# EAGLE design Daughter_ESCON_24-2 (EAGLE 9.3.1)
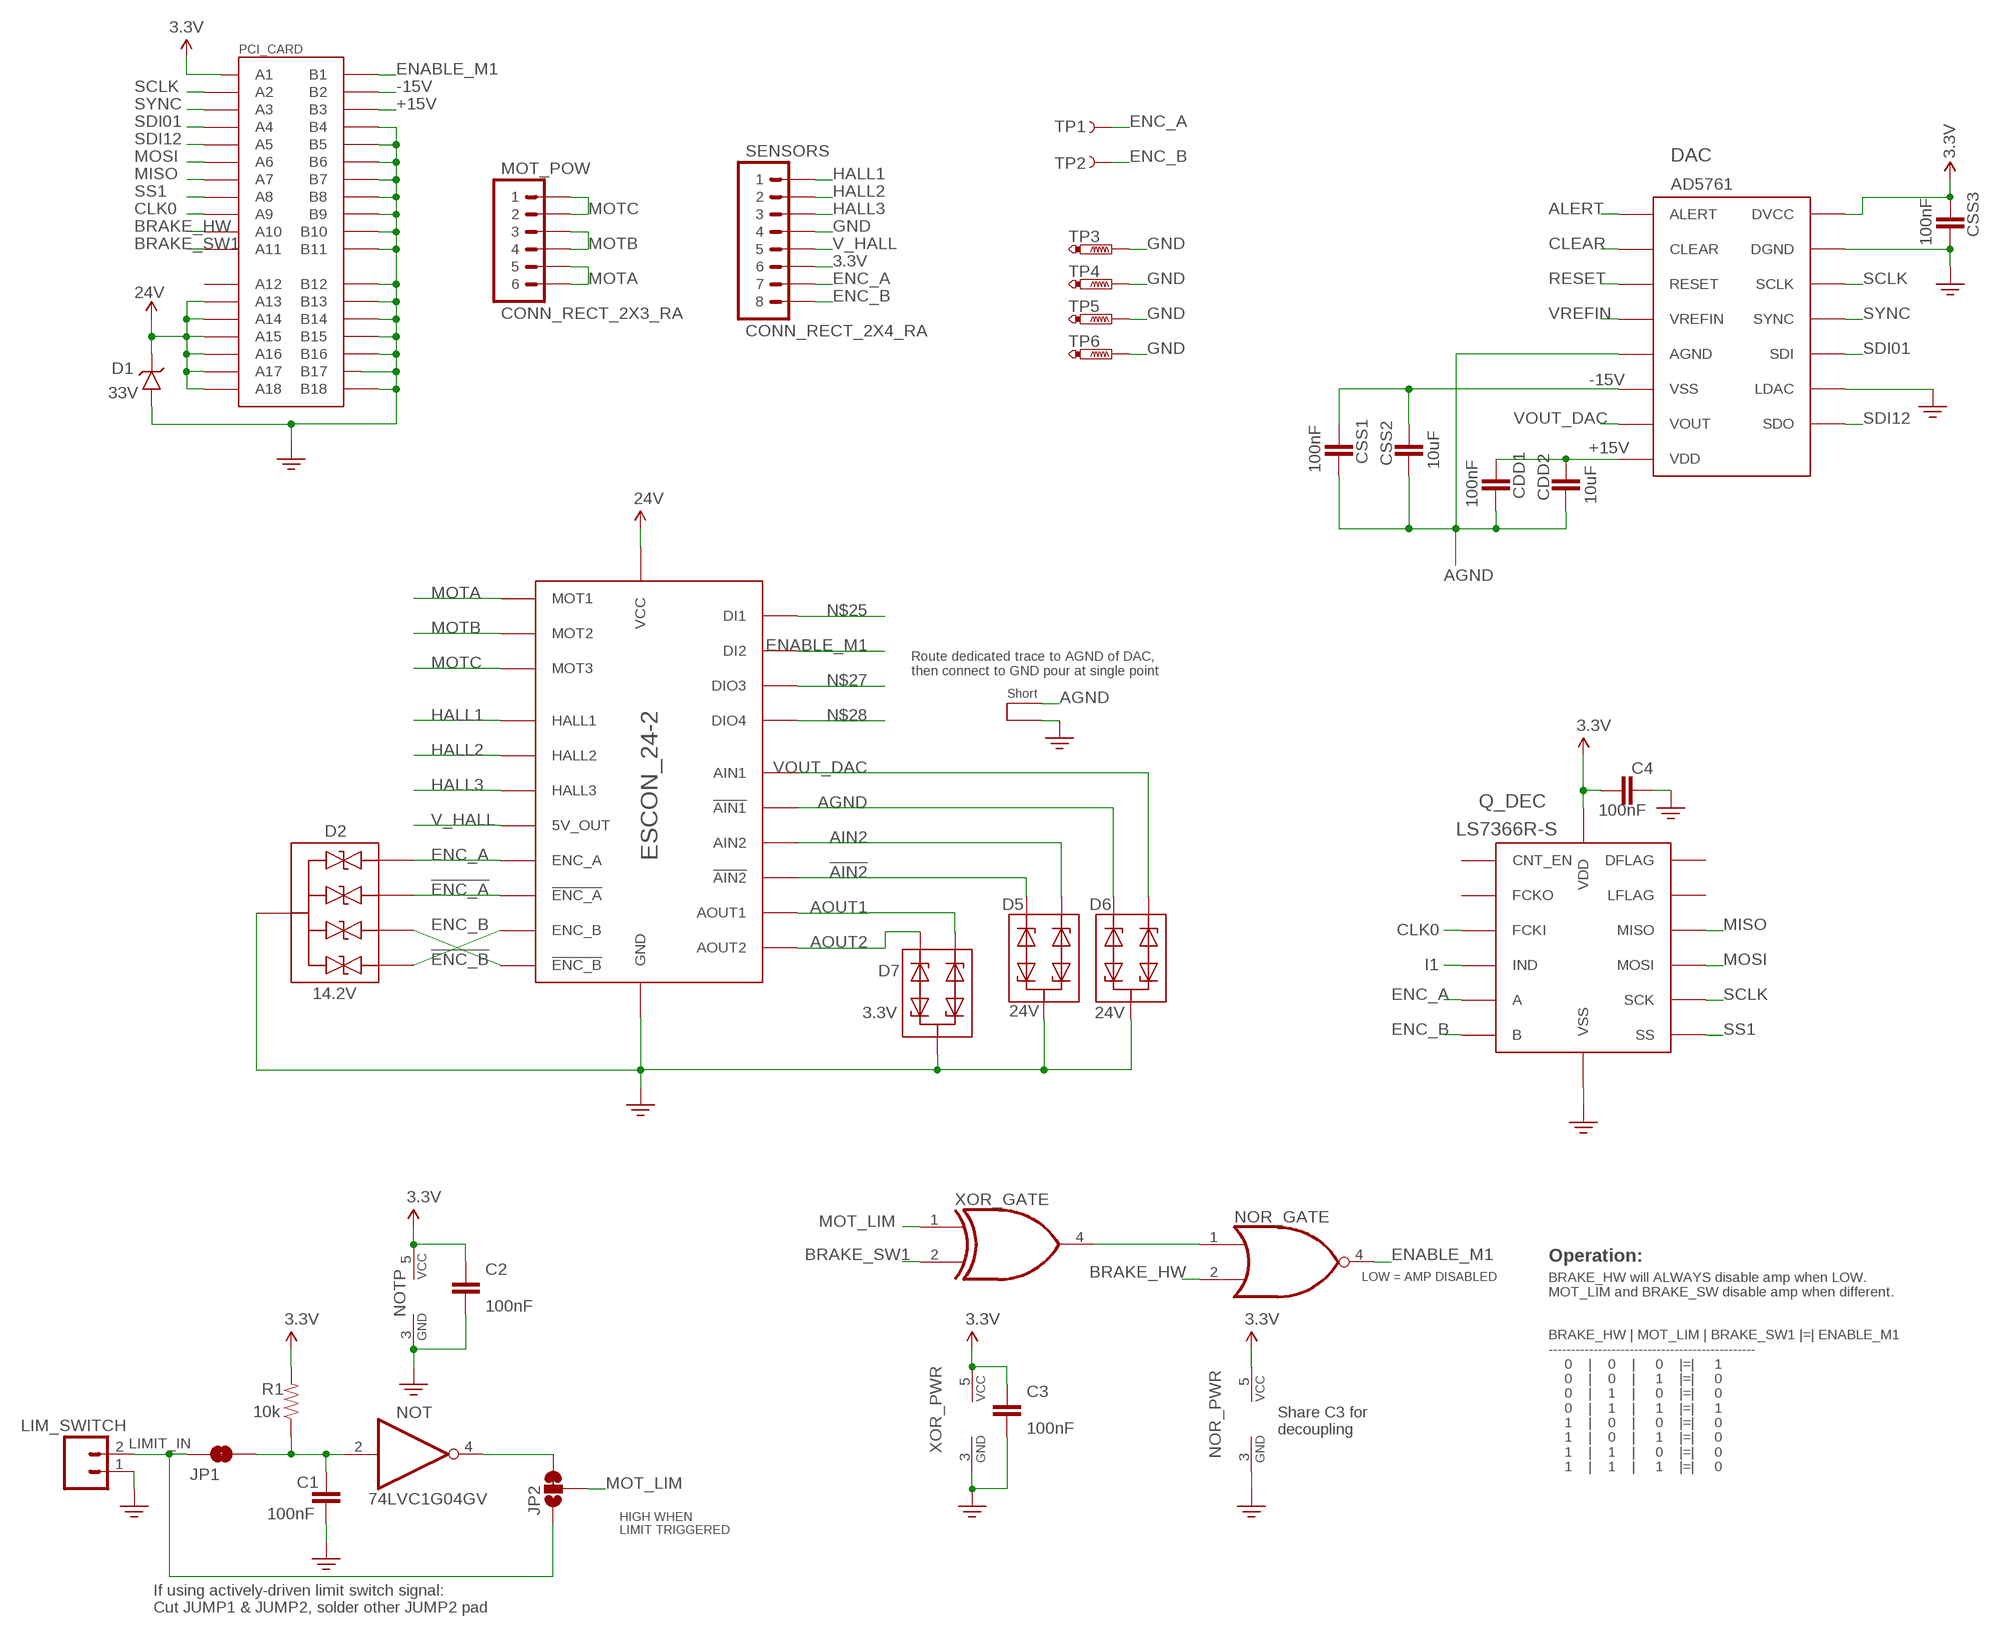
[diagram p0: schematic, sheet 1]

## Parts
C1  100nF  CAP0603-CAP  [0603-CAP]
C2  100nF  CAP0603-CAP  [0603-CAP]
C3  100nF  CAP0603-CAP  [0603-CAP]
C4  100nF  CAP0603-CAP  [0603-CAP]
CDD1  100nF  CAP0603-CAP  [0603-CAP]
CDD2  10uF  CAP0805  [C0805K]
CSS1  100nF  CAP0603-CAP  [0603-CAP]
CSS2  10uF  CAP0805  [C0805K]
CSS3  100nF  CAP0603-CAP  [0603-CAP]
D1  33V  DIODE_TVS_UNIDIR_1  [DO214AA]
D2  14.2V  DIODE_TVS_BIDIR_4  [SOTFL50P160X60-6]
D5  24V  DIODE_TVS_BIDIR_2  [SOT95P230X110-3]
D6  24V  DIODE_TVS_BIDIR_2  [SOT95P230X110-3]
D7  3.3V  DIODE_TVS_BIDIR_2  [SOT95P230X110-3]
DAC  AD5761  [TSSOP16]
ESCON_24-2  ESCON_MODULE24-2_BOTTOM_ENTRY  [ESCON_24-2_BOTTOM_ENTRY]
JP1  JUMPER-PAD-2-NC_BY_TRACE  [PAD-JUMPER-2-NC_BY_TRACE_YES_SILK]
JP2  JUMPER-PAD-3-2OF3_NC_BY_TRACE  [PAD-JUMPER-3-2OF3_NC_BY_TRACE_YES_SILK_FULL_BOX]
LIM_SWITCH  22-05-7028-02  [7395-02]
MOT_POW  CONN_RECT_2X3_RA  [2X3-RA]
NOR  NOR-SOT353  [SOT353]
NOT  74LVC1G04GV  74LVC1G04DBV  [SOT23-5]
PCI_CARD  PCIE-36-EDGE  [PCIE-36-EDGE]
Q_DEC  LS7366R-S  [SOIC-14]
R1  10k  RESISTOR-0603  [0603-RES]
SENSORS  CONN_RECT_2X4_RA  [2X4-RA]
TP1  TEST-POINT_5021  [TEST-POINT_5021]
TP2  TEST-POINT_5021  [TEST-POINT_5021]
TP3  PTR1TP20R  [TP20R]
TP4  PTR1TP20R  [TP20R]
TP5  PTR1TP20R  [TP20R]
TP6  PTR1TP20R  [TP20R]
U$1  SHORT  [SHORT]
XOR  XOR-SOT353  [SOT353]

## Nets
3.3V: C2.1 C3.1 C4.1 CSS3.1 DAC.15(DVCC) NOR.5(_PWR:VCC) NOT.5(VCC) PCI_CARD.A1 Q_DEC.14(VDD) R1.2 SENSORS.6 XOR.5(_PWR:VCC)
24V: D1.C ESCON_24-2.P$4(VCC) PCI_CARD.A13 PCI_CARD.A14 PCI_CARD.A15 PCI_CARD.A16 PCI_CARD.A17 PCI_CARD.A18
!AIN2: D5.1 ESCON_24-2.P$21(!AIN2)
!ENC_A: D2.3(IO2) ESCON_24-2.P$11(!ENC_A)
!ENC_B: D2.4(IO3) ESCON_24-2.P$13(!ENC_B)
+15V: CDD1.1 CDD2.1 DAC.8(VDD) PCI_CARD.B3
-15V: CSS1.1 CSS2.1 DAC.6(VSS) PCI_CARD.B2
AGND: CDD1.2 CDD2.2 CSS1.2 CSS2.2 D6.1 DAC.5(AGND) ESCON_24-2.P$23(!AIN1) U$1.P$1
AIN2: D5.2 ESCON_24-2.P$22(AIN2)
ALERT: DAC.1(ALERT)
AOUT1: D7.2 ESCON_24-2.P$20(AOUT1)
AOUT2: D7.1 ESCON_24-2.P$19(AOUT2)
BRAKE_HW: NOR.2(_GATE:B) PCI_CARD.A10
BRAKE_SW1: PCI_CARD.A11 XOR.2(_GATE:B)
CLEAR: DAC.2(CLEAR)
CLK0: PCI_CARD.A9 Q_DEC.2(FCKI)
ENABLE_M1: ESCON_24-2.P$16(DI2) NOR.4(_GATE:Y) PCI_CARD.B1
ENC_A: D2.1(IO1) ESCON_24-2.P$10(ENC_A) Q_DEC.12(A) SENSORS.7 TP1.P$1
ENC_B: D2.6(IO4) ESCON_24-2.P$12(ENC_B) Q_DEC.11(B) SENSORS.8 TP2.P$1
GND: C1.2 C2.2 C3.2 C4.2 CSS3.2 D1.A D2.2(GND) D2.5(GND) D5.3 D6.3 D7.3 DAC.11(LDAC) DAC.16(DGND) ESCON_24-2.P$5(GND) ESCON_24-2.P$18(GND) LIM_SWITCH.1 NOR.3(_PWR:GND) NOT.3(GND) PCI_CARD.B4 PCI_CARD.B5 PCI_CARD.B6 PCI_CARD.B7 PCI_CARD.B8 PCI_CARD.B9 PCI_CARD.B10 PCI_CARD.B11 PCI_CARD.B12 PCI_CARD.B13 PCI_CARD.B14 PCI_CARD.B15 PCI_CARD.B16 PCI_CARD.B17 PCI_CARD.B18 Q_DEC.3(VSS) SENSORS.4 TP3.TP TP4.TP TP5.TP TP6.TP U$1.P$2 XOR.3(_PWR:GND) ; supply symbol labelled GND2
HALL1: ESCON_24-2.P$7(HALL1) SENSORS.1
HALL2: ESCON_24-2.P$8(HALL2) SENSORS.2
HALL3: ESCON_24-2.P$9(HALL3) SENSORS.3
I1: Q_DEC.10(IND)
LIMIT_IN: JP1.1 JP2.1 LIM_SWITCH.2
MISO: PCI_CARD.A7 Q_DEC.6(MISO)
MOSI: PCI_CARD.A6 Q_DEC.7(MOSI)
MOT_LIM: JP2.2 XOR.1(_GATE:A)
MOTA: ESCON_24-2.P$1(MOT1) MOT_POW.5 MOT_POW.6
MOTB: ESCON_24-2.P$2(MOT2) MOT_POW.3 MOT_POW.4
MOTC: ESCON_24-2.P$3(MOT3) MOT_POW.1 MOT_POW.2
N$5: C1.1 JP1.2 NOT.2(I) R1.1
N$6: JP2.3 NOT.4(O)
N$14: NOR.1(_GATE:A) XOR.4(_GATE:Y)
N$25: ESCON_24-2.P$17(DI1)
N$27: ESCON_24-2.P$15(DIO3)
N$28: ESCON_24-2.P$14(DIO4)
RESET: DAC.3(RESET)
SCLK: DAC.14(SCLK) PCI_CARD.A2 Q_DEC.5(SCK)
SDI01: DAC.12(SDI) PCI_CARD.A4
SDI12: DAC.10(SDO) PCI_CARD.A5
SS1: PCI_CARD.A8 Q_DEC.4(SS)
SYNC: DAC.13(SYNC) PCI_CARD.A3
V_HALL: ESCON_24-2.P$6(5V_OUT) SENSORS.5
VOUT_DAC: D6.2 DAC.7(VOUT) ESCON_24-2.P$24(AIN1)
VREFIN: DAC.4(VREFIN)
Unconnected: PCI_CARD.A12 Q_DEC.1(FCKO) Q_DEC.8(LFLAG) Q_DEC.9(DFLAG) Q_DEC.13(CNT_EN)

## Notes on the sheet
- Route dedicated trace to AGND of DAC, 
  then connect to GND pour at single point
- Operation:
- LOW = AMP DISABLED
- BRAKE_HW will ALWAYS disable amp when LOW.
  MOT_LIM and BRAKE_SW disable amp when different.
- Share C3 for
  decoupling
- BRAKE_HW | MOT_LIM | BRAKE_SW1 |=| ENABLE_M1
  ----------------------------------------------
      0    |    0    |     0    |=|     1
      0    |    0    |     1    |=|     0
      0    |    1    |     0    |=|     0
      0    |    1    |     1    |=|     1
      1    |    0    |     0    |=|     0
      1    |    0    |     1    |=|     0
      1    |    1    |     0    |=|     0
      1    |    1    |     1    |=|     0
- HIGH WHEN
  LIMIT TRIGGERED
- If using actively-driven limit switch signal:
  Cut JUMP1 & JUMP2, solder other JUMP2 pad

## Library data of the parts
C1-C4 CDD1 CSS1 CSS3 = SparkFun-Capacitors:CAP: Capacitor Standard 0603 ceramic capacitor, and 0.1" leaded capacitor.
CDD2 CSS2 = Cannula_1_0:CAP0805
D1 = Cannula_1_0:DIODE_TVS_UNIDIR_1
D2 = Cannula_1_0:DIODE_TVS_BIDIR_4: TVS Diode Network Bidirectional, 4 channels ESDA, TRANSIL series <https://www.st.com/content/ccc/resource/technical/document/datasheet/12/9a/72/50/3e/c0/4e/7e/CD00091403.pdf/files/CD00091403.pdf/jcr:content/translations/en.CD00091403.pdf> by STMicroelectronics Trevor Bruns October 2018
D5-D7 = Cannula_1_0:DIODE_TVS_BIDIR_2: TVS Diode Network Bidirectional, 2 channels PESD1CAN <https://assets.nexperia.com/documents/data-sheet/PESD1CAN.pdf> by Nexperia Trevor Bruns October 2018
DAC = Cannula_1_0:AD5761: AD5761R Multiple Range, 16-bit, Bipolar/Unipolar Voltage Output DAC datasheet <http://www.analog.com/media/en/technical-documentation/data-sheets/AD5761R_5721R.pdf> Trevor Bruns- 2015
ESCON_24-2 = Cannula_1_0:ESCON_MODULE
JP1 = SparkFun-Passives:JUMPER-PAD-2-NC_BY_TRACE
JP2 = SparkFun-Passives:JUMPER-PAD-3-2OF3_NC_BY_TRACE
LIM_SWITCH = Cannula_1_0:22-?-02: CONNECTOR wire to board 2.54 mm (.1 inch) pitch header; OC_FARNELL: 9731601; OC_NEWARK: unknown
MOT_POW = Cannula_1_0:CONN_RECT_2X3
NOR = Cannula_1_0:NOR: Single 2-Input NOR Gate Digikey: 74AHC1G02SE-7DICT-ND Datasheet <http://www.diodes.com/datasheets/74AHC1G02.pdf> Trevor Bruns 6/1/2015
NOT = 74xx-little-us:74*1G04: INVERTER Gate
PCI_CARD = Cannula_1_0:PCIE-36-*: PCI-E 36-way connectors
Q_DEC = Cannula_1_0:LS7366R: LS7366R 32-Bit Quadrature Counter with SPI datasheet <http://www.lsicsi.com/pdfs/Data_Sheets/LS7366R.pdf> Trevor Bruns- 2015
R1 = Cannula_1_0:RESISTOR
SENSORS = Cannula_1_0:CONN_RECT_2X4
TP1 TP2 = Cannula_1_0:TEST-POINT: Bare copper test points for troubleshooting or ICT
TP3-TP6 = testpad:PTR1: TEST PIN
U$1 = Cannula_1_0:SHORT
XOR = Cannula_1_0:XOR

## Board
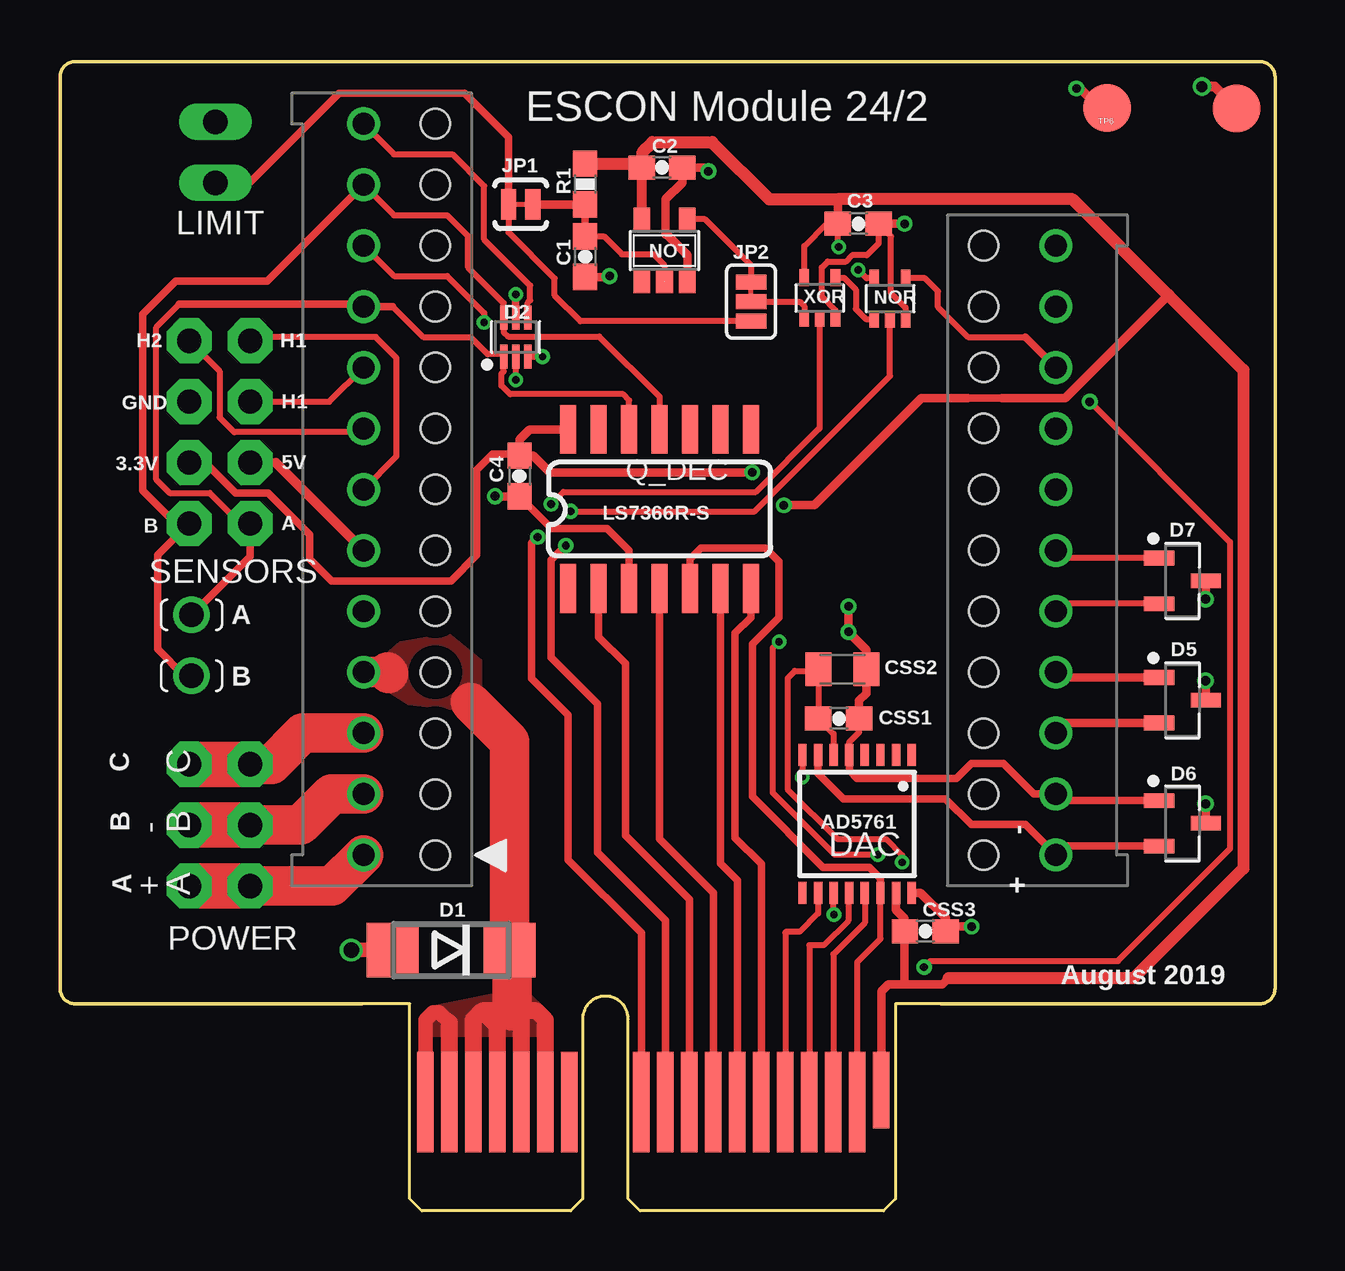
[diagram p1: board, top side]
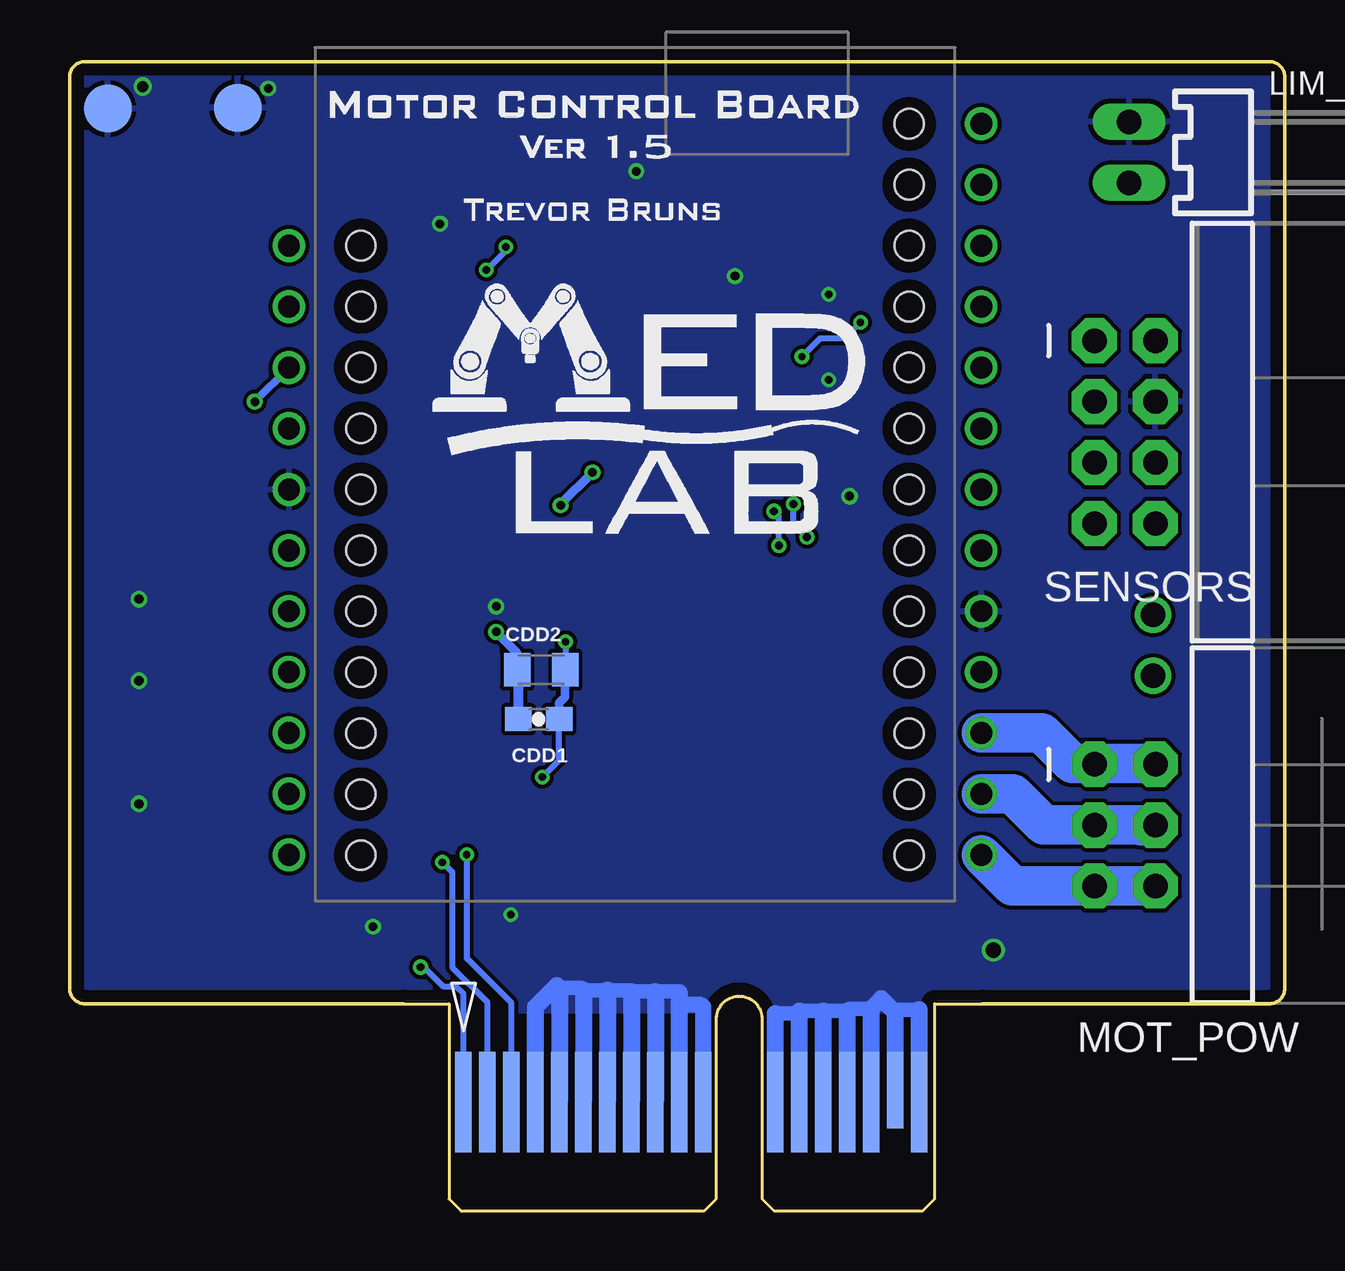
[diagram p2: board, bottom side, seen from below]

Size 50.65 x 47.9 mm. Coordinates in mm from the lower left corner, seen from the top.
Outline: 12.6,8.64 0.63,8.64 arc-90 0,9.27 0,47.27 arc-90 0.63,47.9 50.01,47.9 arc-90 50.65,47.27 50.65,9.27 arc-90 50.01,8.64 36.73,8.64
Copper layers (1*16): Top 0.035mm / dielectric 1.5mm / Bottom 0.035mm
Design rules "PCBWay_2018-01-18 *": minimum track width 6mil, minimum drill 12mil, track to track 6.5mil, track to pad 6.5mil, pad to pad 6.5mil, via to via 6.5mil, smd to smd 6mil, copper to edge 20mil, drill to drill 8mil, minimum pad ring 6mil, minimum via ring 6mil, stop-mask expansion 4mil, vias tented up to drill 0mil, thermal gap 8mil

### Footprints (pad centres in the part's own frame; a part is rotated, then mirrored left to right if it is on the bottom)
0603-CAP = smd 1.1 x 1: 1 -0.85,0; 2 0.85,0
C0805K = smd 1.1 x 1.4: 1 -1,0; 2 1,0
DO214AA = smd 2.159 x 2.261: A 2.438,0; C -2.438,0
SOTFL50P160X60-6 = smd 0.991 x 0.297: 1 -0.813,0.5; 2 -0.813,0; 3 -0.813,-0.5; 4 0.813,-0.5; 5 0.813,0; 6 0.813,0.5
SOT95P230X110-3 = smd 1.259 x 0.609: 1 -0.978,0.95; 2 -0.978,-0.95; 3 0.978,0
TSSOP16 = smd 0.9 x 0.35: 1 -2.875,2.275; 2 -2.875,1.625; 3 -2.875,0.975; 4 -2.875,0.325; 5 -2.875,-0.325; 6 -2.875,-0.975; 7 -2.875,-1.625; 8 -2.875,-2.275; 9 2.875,-2.275; 10 2.875,-1.625; 11 2.875,-0.975; 12 2.875,-0.325; 13 2.875,0.325; 14 2.875,0.975; 15 2.875,1.625; 16 2.875,2.275
ESCON_24-2_BOTTOM_ENTRY = drill 0.914: P$1 14.427,-15.24; P$2 14.427,-12.7; P$3 14.427,-10.16; P$4 14.427,-7.62; P$5 14.427,-5.08; P$6 14.427,-2.54; P$7 14.427,0; P$8 14.427,2.54; P$9 14.427,5.08; P$10 14.427,7.62; P$11 14.427,10.16; P$12 14.427,12.7; P$13 14.427,15.24; P$14 -14.427,10.16; P$15 -14.427,7.62; P$16 -14.427,5.08; P$17 -14.427,2.54; P$18 -14.427,0; P$19 -14.427,-2.54; P$20 -14.427,-5.08; P$21 -14.427,-7.62; P$22 -14.427,-10.16; P$23 -14.427,-12.7; P$24 -14.427,-15.24 | hole 1.219: -11.43,10.16; -11.43,7.62; -11.43,5.08; -11.43,2.54; -11.43,0; -11.43,-2.54; -11.43,-5.08; -11.43,-7.62; -11.43,-10.16; -11.43,-12.7; -11.43,-15.24; 11.43,-15.24; 11.43,-12.7; 11.43,-10.16; 11.43,-7.62; 11.43,-5.08; 11.43,-2.54; 11.43,0; 11.43,2.54; 11.43,5.08; 11.43,7.62; 11.43,10.16; 11.43,12.7; 11.43,15.24
PAD-JUMPER-2-NC_BY_TRACE_YES_SILK = smd 0.635 x 1.27: 1 -0.508,0; 2 0.508,0
PAD-JUMPER-3-2OF3_NC_BY_TRACE_YES_SILK_FULL_BOX = smd 0.635 x 1.27: 1 -0.813,0; 2 0,0; 3 0.813,0
7395-02 = drill 1.016 long: 1 1.27,0; 2 -1.27,0
2X3-RA = drill 1.016 pad 1.88 octagon: 1 -1.27,2.54; 2 1.27,2.54; 3 -1.27,0; 4 1.27,0; 5 -1.27,-2.54; 6 1.27,-2.54
SOT353 = smd 0.4 x 0.7: 1 -0.65,-0.85; 2 0,-0.85; 3 0.65,-0.85; 4 0.65,0.85; 5 -0.65,0.85
SOT23-5 = smd 0.69 x 0.99: 1 -0.95,-1.29; 2 0,-1.29; 3 0.95,-1.29; 4 0.95,1.3; 5 -0.95,1.3
PCIE-36-EDGE = smd 0.7 x 3.2 bottom: A1 -11.5,-3.6 | smd 0.7 x 4.2 bottom: A2 -10.5,-4.1; A3 -9.5,-4.1; A4 -8.5,-4.1; A5 -7.5,-4.1; A6 -6.5,-4.1; A7 -5.5,-4.1; A8 -4.5,-4.1; A9 -3.5,-4.1; A10 -2.5,-4.1; A11 -1.5,-4.1; A12 1.5,-4.1; A13 2.5,-4.1; A14 3.5,-4.1; A15 4.5,-4.1; A16 5.5,-4.1; A17 6.5,-4.1; A18 7.5,-4.1 | smd 0.7 x 4.2: B1 -11.5,-4.1; B2 -10.5,-4.1; B3 -9.5,-4.1; B4 -8.5,-4.1; B5 -7.5,-4.1; B6 -6.5,-4.1; B7 -5.5,-4.1; B8 -4.5,-4.1; B9 -3.5,-4.1; B10 -2.5,-4.1; B11 -1.5,-4.1; B12 1.5,-4.1; B13 2.5,-4.1; B14 3.5,-4.1; B15 4.5,-4.1; B16 5.5,-4.1; B18 7.5,-4.1 | smd 0.7 x 3.2: B17 6.5,-3.6
SOIC-14 = smd 0.66 x 2.032: 1 -4.445,-3.315; 2 -3.175,-3.315; 3 -1.905,-3.315; 4 -0.635,-3.315; 5 0.635,-3.315; 6 1.905,-3.315; 7 3.175,-3.315; 8 3.175,3.315; 9 1.905,3.315; 10 0.635,3.315; 11 -0.635,3.315; 12 -1.905,3.315; 13 -3.175,3.315; 14 -4.445,3.315
0603-RES = smd 1.1 x 1: 1 -0.85,0; 2 0.85,0
2X4-RA = drill 1.016 pad 1.88 octagon: 1 -1.27,3.81; 2 1.27,3.81; 3 -1.27,1.27; 4 1.27,1.27; 5 -1.27,-1.27; 6 1.27,-1.27; 7 -1.27,-3.81; 8 1.27,-3.81
TEST-POINT_5021 = drill 1.016: P$1 0,0
TP20R = smd 2 x 2: TP 0,0
SHORT = smd 0.127 x 0.127: P$1 0,0; P$2 0,0

### Placement (x,y rotation side)
C1  21.89,39.78 270 top
C2  25.1,43.48 0 top
C3  33.27,41.15 0 top
C4  19.15,30.63 270 top
CDD1  31.09,20.5 180 bottom
CDD2  30.99,22.55 180 bottom
CSS1  32.46,20.52 0 top
CSS2  32.61,22.58 0 top
CSS3  36.07,11.66 0 top
D1  16.31,10.87 180 top
D2  19,36.42 90 top
D5  46.79,21.28 0 top
D6  46.79,16.15 0 top
D7  46.79,26.26 0 top
DAC  33.22,16.13 270 top
ESCON_24-2  27.08,30.07 0 bottom
JP1  19.2,41.96 0 top
JP2  28.8,37.9 90 top
LIM_SWITCH  6.48,44.12 90 bottom
MOT_POW  6.65,16.08 0 bottom
NOR  34.59,38.02 0 top
NOT  25.2,40.03 0 top
PCI_CARD  22.73,8.63 0 bottom
Q_DEC  25.63,29.26 0 top
R1  21.89,42.8 90 top
SENSORS  6.65,32.46 0 bottom
TP1  5.49,24.84 0 top
TP2  5.49,22.3 0 top
TP3  43.64,45.97 0 bottom
TP4  49.05,45.95 0 top
TP5  49.05,45.95 0 bottom
TP6  43.64,45.97 0 top
U$1  32.87,24.13 0 top
U$3  [LOGO_MEDLAB_0.7X0.4]  26.42,33.07 0 bottom
U$4  [LOGO_MOTOR_CONTROL_1.5_SMALL]  28.7,44.2 0 bottom
XOR  31.67,38.05 0 top

### Tracks (layer width: path | path; a pad name or v marks a point on that pad's centre or on a via)
3.3V  (via drill 0.3, 0.36)
  Top 0.254: NOR.5 33.62,38.87 v33.27,39.22 | XOR.5 31.02,40.22 31.95,41.15 C3.1 32.42,40.22 v32.46,40.18 | 19.09,31.55 C4.1
  Top 0.305: SENSORS.6 6.04,31.19 7.31,29.92 8.69,29.92 10.41,28.19 10.41,27.18 11.33,26.26 16.31,26.26 17.37,27.33 17.37,30.89 18.03,31.55 19.09,31.55 | 37.85,33.88 39.27,33.88
  Top 0.356: DAC.15 34.85,12.55 35.2,12.2 35.2,11.64 35.2,9.51 35.25,9.45 | PCI_CARD.A1 34.23,9.14 34.54,9.45 35.25,9.45 | 24.08,43.65 C2.1 24.28,43.52 | C3.1 32.42,42.15 32.41,42.16 | Q_DEC.14 19.57,32.57 19.15,32.16 C4.1 19.72,31.48 20.42,30.78 v28.85,30.78 | v30.17,29.41 31.44,29.41 35.92,33.88 37.85,33.88 | 39.27,33.88 41.91,33.88 46.2,38.18 | 35.25,9.45 36.78,9.45 37.03,9.7
  Top 0.406: 35.2,11.64 CSS3.1 | C2.1 NOT.5
  Top 0.508: R1.2 24.08,43.65 | 24.28,43.52 24.28,44.14 24.69,44.55 27.18,44.55 29.57,42.16 32.41,42.16 42.21,42.16 46.2,38.18 49.33,35.05 49.33,14.27 44.75,9.7 37.03,9.7
  Bottom 0.254: v33.27,39.22 32.46,40.03 v32.46,40.18
  Bottom 0.356: v28.85,30.78 30.17,29.46 v30.17,29.41
24V
  Top 0.61: PCI_CARD.A18 15.23,7.97 15.54,8.28 15.8,8.28 16.23,7.85
  Top 0.699: PCI_CARD.A13 20.23,7.96 | PCI_CARD.A16 17.23,7.96 | PCI_CARD.A17 16.23,7.85
  Top 0.711: 20.23,7.96 19.86,8.33 18.85,8.33 | 17.6,8.33 17.23,7.96 | 18.85,8.33 17.6,8.33 | PCI_CARD.A15 18.23,7.7 17.6,8.33 | PCI_CARD.A14 19.23,7.94 18.85,8.33
  Top 1.016: 17,21.3 16.8,21.3
  Top 1.27: ESCON_24-2.P$4 13.65,22.45
  Top 1.651: 13.65,22.45 13.7,22.4 | 18.85,8.33 18.85,10.77 D1.C 18.74,19.56 17.12,21.18
  pour Top: 19.31,9.31 20.12,8.55 20.07,7.26 14.88,7.26 15.47,8.54
  pour Top (no thermals): 13.56,23.21 14.17,23.72 16.21,24.08 17.58,22.96 17.58,20.73 14.53,21.08 13.56,21.69
!AIN2
  Top 0.305: ESCON_24-2.P$21 41.72,22.23
  Top 0.356: 41.72,22.23 D5.1
!ENC_A  (via drill 0.3)
  Top 0.254: v17.68,37.03 17.68,37.42 16.14,38.96 13.92,38.96 ESCON_24-2.P$11 | D2.3 v20.12,35.61
  Bottom 0.254: v17.68,37.03 18.34,36.37 19.35,36.37 v20.12,35.61
!ENC_B
  Top 0.254: ESCON_24-2.P$13 13.92,44.04 16.36,44.04 17.68,42.72 17.68,40.49 19.6,38.57 19.6,37.95 19.5,37.86 D2.4
+15V  (via drill 0.3)
  Top 0.254: v29.97,23.72 29.72,23.47 29.72,17.42 32.3,14.84 v34.09,14.84 | DAC.8 30.95,18.1 v30.94,18.08
  Bottom 0.254: v29.97,23.72 29.97,22.57 CDD2.1 | v30.94,18.08 30.24,18.78 CDD1.1 | PCI_CARD.B3 32.23,8.66 34.09,10.51 v34.09,14.83 v34.09,14.84
  Bottom 0.356: CDD1.1 30.24,21.17 29.99,21.42 CDD2.1
-15V  (via drill 0.3)
  Top 0.254: CSS2.1 | CSS2.1 CSS1.1 32.25,19.89 DAC.6 | CSS2.1 31.54,22.5 30.63,22.5 30.33,22.2 30.33,17.58 32.41,15.49 34.44,15.49 35.1,14.83 v35.1,14.53
  Bottom 0.254: v35.1,14.53 34.7,14.12 34.7,10.16 33.23,8.7 PCI_CARD.B2
AGND  (via drill 0.36)
  Top 0.254: DAC.5 32.9,19.54 33.31,19.95 CSS1.2
  Top 0.305: DAC.5 32.9,18.36 33.22,18.03 37.37,18.03 37.98,18.64 39.32,18.64 40.59,17.37 ESCON_24-2.P$23 41.77,17.1 D6.1
  Top 0.356: CSS1.2 33.31,21.27 33.61,21.57 CSS2.2 33.61,23.38 U$1.P$1
  Bottom 0.356: U$1.P$1 31.99,23.25 CDD2.2
  Bottom 0.406: CDD1.2 31.94,22.51 CDD2.2
  other vias: 32.87,24.13
AIN2
  Top 0.305: ESCON_24-2.P$22 41.92,20.33
  Top 0.356: 41.92,20.33 D5.2
AOUT1
  Top 0.254: D7.2 41.82,25.31 ESCON_24-2.P$20
AOUT2
  Top 0.254: D7.1 41.82,27.21 ESCON_24-2.P$19
BRAKE_HW  (via drill 0.33)
  Top 0.254: NOR.2 34.59,34.8 28.96,29.16 v21.28,29.16
  Top 0.305: v21.08,27.74 20.47,27.13 20.47,23.06 22.4,21.13 22.4,14.93 25.23,12.1 PCI_CARD.A10
  Bottom 0.254: v21.08,27.74 21.08,28.96 v21.28,29.16
BRAKE_SW1  (via drill 0.33)
  Top 0.254: v20.47,29.46 20.98,29.97 29.01,29.97 31.62,32.59 31.62,32.58 31.67,32.63 XOR.2
  Top 0.305: PCI_CARD.A11 24.23,11.58 21.18,14.63 21.18,20.67 19.66,22.2 19.66,27.84 v19.91,28.09
  Bottom 0.254: v19.91,28.09 20.47,28.65 v20.47,29.46
CLK0
  Top 0.305: PCI_CARD.A9 26.23,12.98 23.57,15.65 23.57,22.81 22.45,23.93 Q_DEC.2
ENABLE_M1  (via drill 0.33, 0.36)
  Top 0.254: NOR.4 36.06,38.87 36.6,38.33 36.6,37.67 37.85,36.42 40.23,36.42 | v36.02,10.16 36.27,10.41 44.09,10.41 48.77,15.09 48.77,27.89 v42.93,33.73
  Top 0.305: 40.23,36.42 ESCON_24-2.P$16
  Bottom 0.254: PCI_CARD.B1 34.23,9.06 34.52,9.35 35.05,9.35 35.86,10.16 v36.02,10.16
  Bottom 0.305: ESCON_24-2.P$16 v42.93,33.73
ENC_A
  Top 0.254: 4.98,37.79 4.01,36.83 4.01,30.48 4.57,29.92 6.25,29.92 7.52,28.65 SENSORS.7 | 12.55,37.79 ESCON_24-2.P$10 | 13.87,37.69 15.14,36.42 17.12,36.42 17.83,35.71 18.4,35.71 D2.1 18.5,34.99 18.4,34.89 18.4,34.4 18.76,34.04 23.47,34.04 23.72,33.78 Q_DEC.12
  Top 0.305: SENSORS.7 7.92,27.28 TP1.P$1 | 4.98,37.79 12.55,37.79 | ESCON_24-2.P$10 13.87,37.69
ENC_B
  Top 0.254: Q_DEC.11 24.99,33.93 22.48,36.45 18.67,36.45 18.5,36.62 D2.6 18.5,37.84 17.02,39.32 17.02,40.62 16.14,41.5 13.92,41.5 ESCON_24-2.P$12
  Top 0.305: TP2.P$1 5.18,22.3 4.06,23.42 4.06,27.33 SENSORS.8 4.83,28.65 3.45,30.02 3.45,37.39 4.83,38.76 8.64,38.76 ESCON_24-2.P$12
GND  (via drill 0.3, 0.36, 0.38, 0.46, 0.64)
  Top 0.254: v32.26,12.34 32.25,12.35 DAC.11 | NOR.3 35.24,37.65 34.65,38.25 34.65,40.63 C3.2 34.12,40.32 33.63,39.83 33.02,39.83 32.77,39.57 32,39.57 31.75,39.32 31.75,38.1 32.32,37.53 XOR.3 | D2.2 v19,34.64
  Top 0.305: Q_DEC.3 23.72,27.53 22.81,28.45 20.49,28.45 C4.2 | D2.5 v19,38.2
  Top 0.356: DAC.16 35.87,13.25 36.92,12.2 CSS3.2 37.11,11.85 v38,11.85 | v32.87,25.2 U$1.P$2 | v18.14,29.79 v18.15,29.78 C4.2 | C1.2 22.87,38.93 v22.91,38.96 | NOT.3 26.15,39.84 25.3,40.69 25.25,40.69 25.25,42.16 25.94,42.86 C2.2 26.87,43.48 v27.03,43.33 | C3.2 v35.2,41.15 | TP6.TP 43.33,45.97 42.52,46.79 v42.37,46.79 | D6.3 47.76,16.95 v47.75,16.97 | D5.3 47.76,22.08 v47.75,22.1 | D7.3 47.76,25.51 v47.75,25.5
  Top 0.406: v47.6,46.86 48.13,46.86 TP5.TP
  Top 0.61: D1.A v12.14,10.87
  Bottom 0.61: 17.23,8.42 18.14,8.42 18.23,8.33 19.23,8.33 20.23,8.33 20.33,8.23 21.23,8.23 | 15.23,8.39 16.1,8.39 16.23,8.26 | 25.23,9.09 25.28,9.14 26.23,9.14 27.23,9.14 27.28,9.19 28.23,9.19 29.23,9.19 29.33,9.3 30.23,9.3 30.33,9.4
  Bottom 0.66: PCI_CARD.B11 24.23,8.51 24.31,8.58 25.23,8.58
  Bottom 0.699: PCI_CARD.B12 21.23,8.23 | PCI_CARD.B13 20.23,8.33 | PCI_CARD.B14 19.23,8.33 | PCI_CARD.B15 18.23,8.33 | PCI_CARD.B16 17.23,8.42 16.81,8.84 16.23,8.26 PCI_CARD.B17 | PCI_CARD.B18 15.23,8.39 | 30.23,9.3 PCI_CARD.B5 | 29.23,9.19 PCI_CARD.B6 | 28.23,9.19 PCI_CARD.B7 | 27.23,9.14 PCI_CARD.B8 | 26.23,9.14 PCI_CARD.B9 | PCI_CARD.B10 25.23,8.58 25.23,9.09
  Bottom 0.711: PCI_CARD.B4 31.23,8.5 30.33,9.4
  pour Bottom (rank 2): 52.37,49.48 -0.97,49.48 -0.41,8.33 52.57,8.33
HALL1
  Top 0.254: SENSORS.1 8.08,36.42 13.16,36.42 14.02,35.56 14.02,31.44 ESCON_24-2.P$7
HALL2
  Top 0.254: SENSORS.2 6.65,35 6.65,33.07 7.26,32.46 12.5,32.46 ESCON_24-2.P$8
HALL3
  Top 0.254: SENSORS.3 11.23,33.73 ESCON_24-2.P$9
LIMIT_IN
  Top 0.254: JP2.1 21.69,37.08 20.62,38.15 20.62,38.86 18.69,40.79 JP1.1
  Top 0.305: LIM_SWITCH.2 7.9,42.85 11.63,46.58 16.87,46.58 18.69,44.75 JP1.1
MISO
  Top 0.305: Q_DEC.6 27.53,14.48 28.24,13.77 28.24,4.55 PCI_CARD.A7
MOSI
  Top 0.305: Q_DEC.7 28.8,24.74 28.14,24.08 28.14,15.54 29.23,14.45 PCI_CARD.A6
MOT_LIM
  Top 0.254: JP2.2 30.84,37.9 31.02,37.71 XOR.1
MOTA
  Top 1.651: ESCON_24-2.P$1 11.35,13.54 MOT_POW.5
  Top 1.905: MOT_POW.5 MOT_POW.6
  Bottom 1.651: ESCON_24-2.P$1 11.35,13.54 MOT_POW.6
MOTB
  Top 1.651: ESCON_24-2.P$2 11.33,17.37 10.03,16.08 MOT_POW.3
  Top 1.905: MOT_POW.3 MOT_POW.4
  Bottom 1.651: ESCON_24-2.P$2 11.33,17.37 10.03,16.08 MOT_POW.3 5.97,16.08 5.94,16.05
MOTC
  Top 1.651: MOT_POW.1 8.81,18.62 10.11,19.91 ESCON_24-2.P$3
  Top 1.905: MOT_POW.1 MOT_POW.2
  Bottom 1.651: ESCON_24-2.P$3 10.11,19.91 8.84,18.64 5.41,18.64 MOT_POW.2
N$5
  Top 0.254: C1.1 22.67,40.63 23.42,39.88 24.74,39.88 25.2,39.42 NOT.2
  Top 0.305: R1.1 C1.1
  Top 0.356: JP1.2 19.72,41.95 R1.1
N$6
  Top 0.254: JP2.3 28.8,39.42 26.89,41.33 NOT.4
N$14
  Top 0.254: XOR.4 32.68,38.9 33.17,38.4 33.17,37.59 33.59,37.17 NOR.1
SCLK
  Top 0.254: PCI_CARD.A2 33.23,10.37 34.2,11.34 DAC.14
  Top 0.305: Q_DEC.5 26.26,27.18 26.72,27.63 29.41,27.63 29.97,27.08 29.97,24.74 28.85,23.62 28.85,17.27 31.8,14.32 33.73,14.32 34.2,13.86 DAC.14
SDI01
  Top 0.254: DAC.12 32.85,13.21 32.85,12.1 31.83,11.07 31.23,11.07 PCI_CARD.A4
SDI12
  Top 0.254: DAC.10 31.6,12.4 30.84,11.63 30.28,11.63 30.23,11.59 PCI_CARD.A5
SS1
  Top 0.305: PCI_CARD.A8 27.23,13.25 24.99,15.49 Q_DEC.4
SYNC
  Top 0.254: DAC.13 33.55,12.01 32.23,10.69 PCI_CARD.A3
V_HALL
  Top 0.356: SENSORS.5 8.99,31.19
  Top 0.406: 8.99,31.19 ESCON_24-2.P$6
VOUT_DAC
  Top 0.305: DAC.7 31.6,18.24 32.66,17.17 36.91,17.17 37.98,16.1 40.23,16.1 ESCON_24-2.P$24 41.87,15.2 D6.2

### Text on the board
tPlace: ESCON Module 24/2 | LIMIT | H2 | H1 | GND | H1 | 3.3V | 5V | B | A | SENSORS | A | B | C | C | B | - | B | - | A | + | A | + | POWER | August 2019
_tNames: DAC | Q_DEC
_bNames: MOT_LIM | SENSORS | TP13 | MOT_POW